# Altium schematic sheet TOP.SchDoc: TOP
size A3; CompanyName: STMicroelectronics; Organization: Microcontrollers Division; DocumentNumber: 3; SheetNumber: 2; SheetTotal: 19
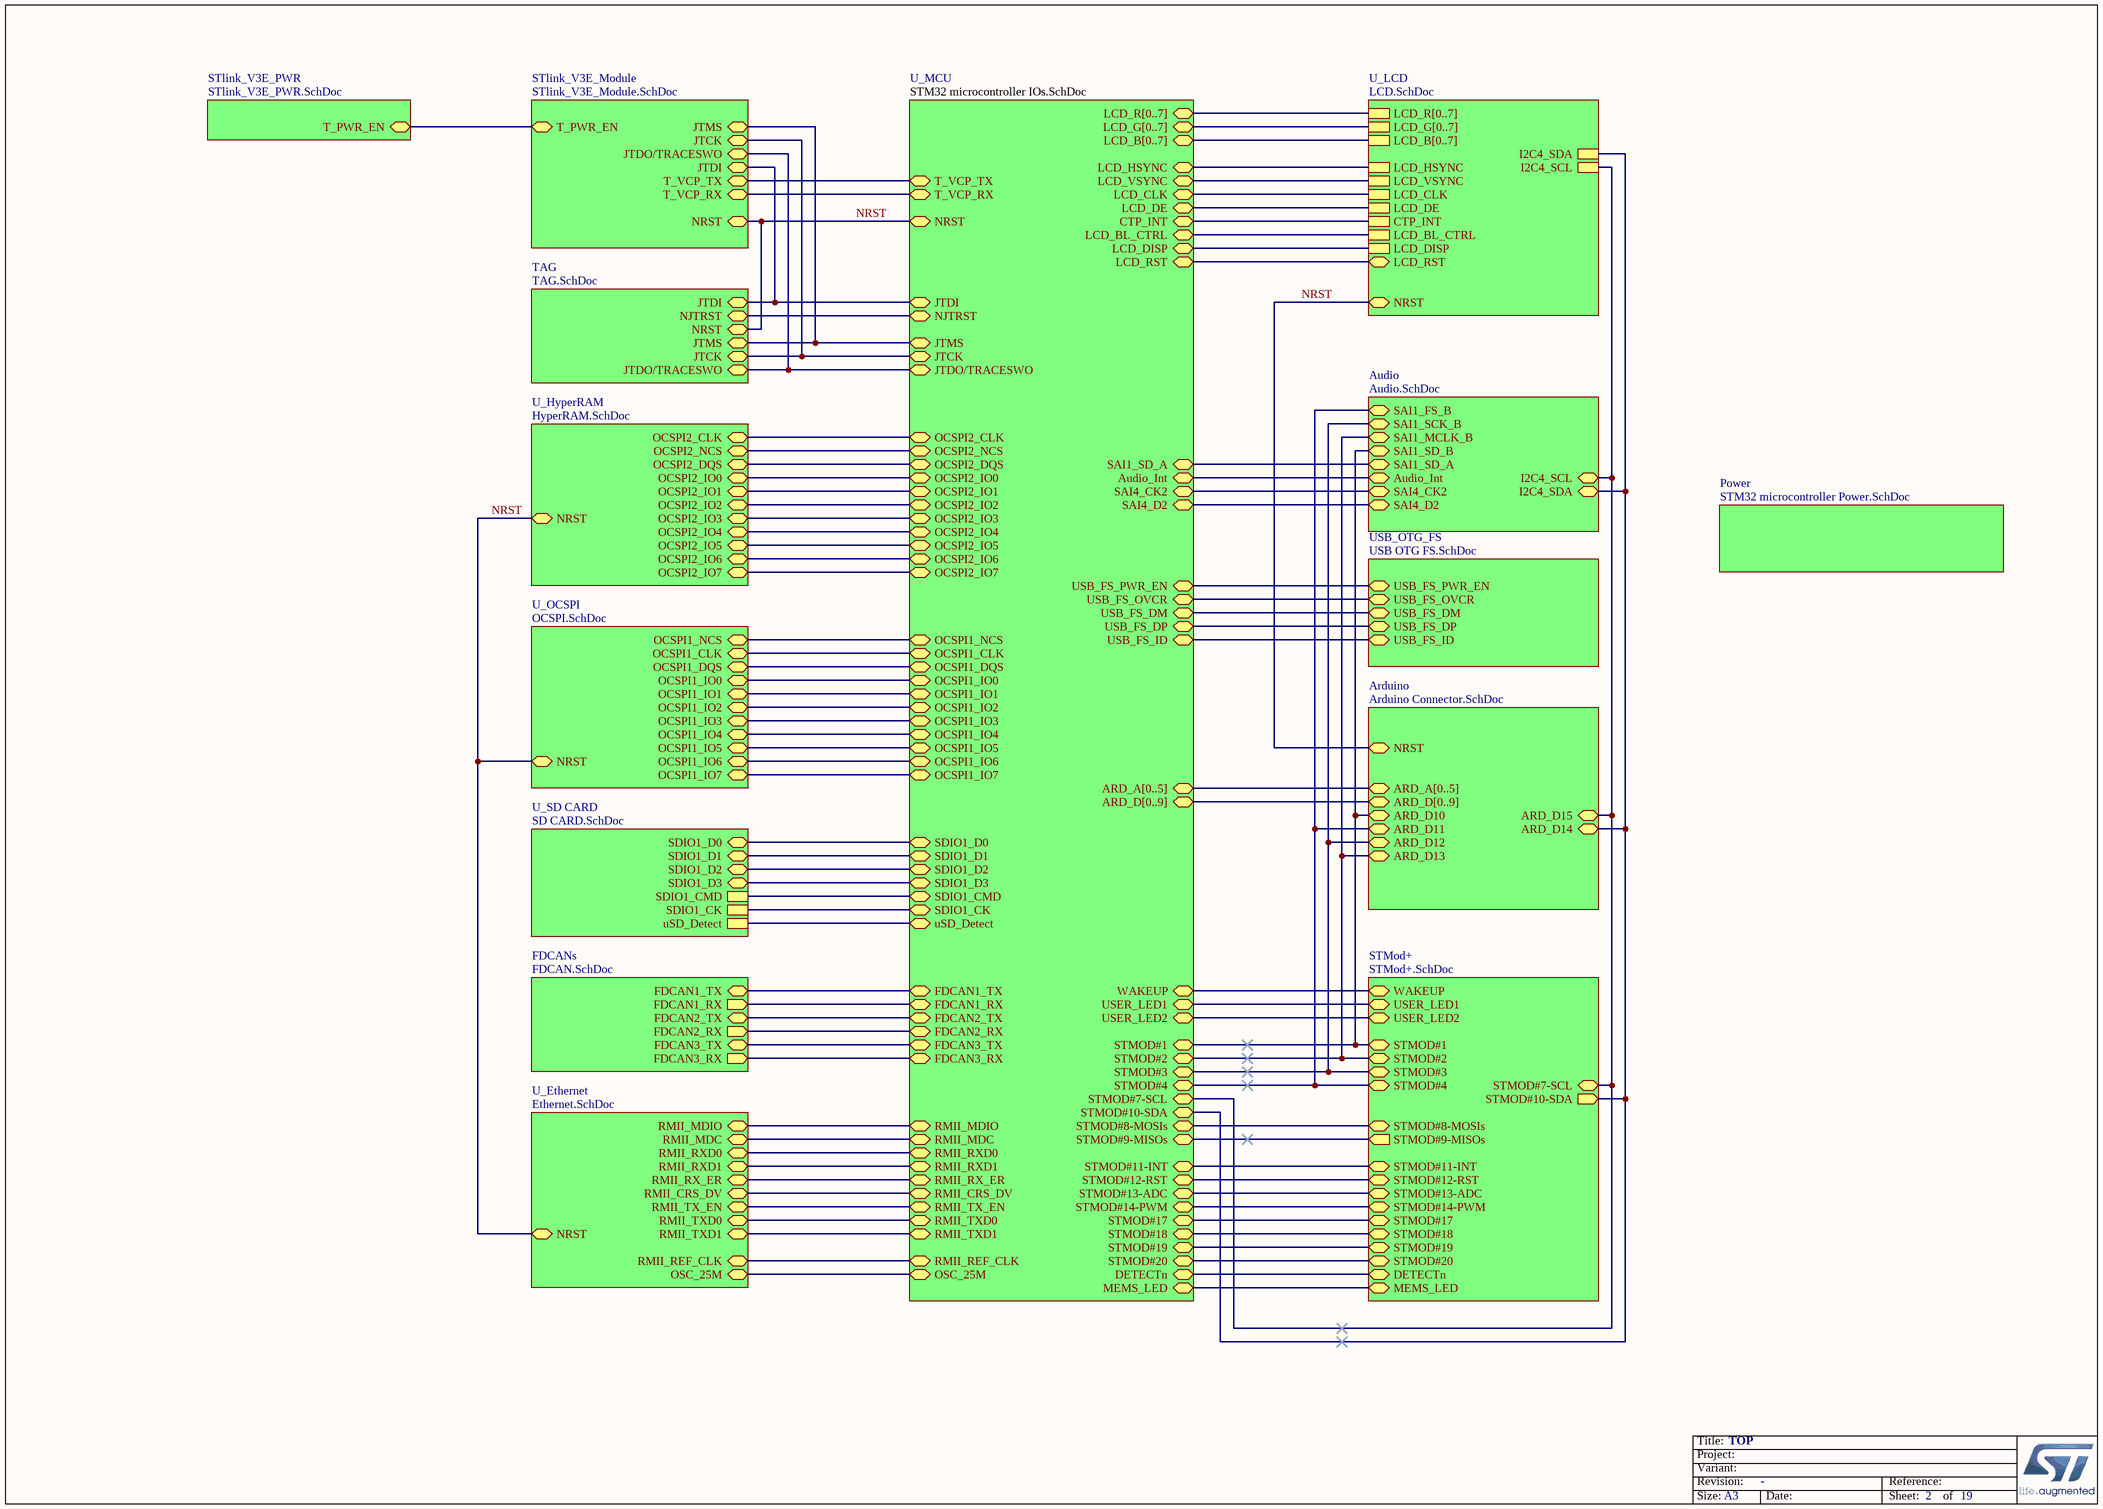
[diagram p0: TOP.SchDoc]

## Sub-sheets
Arduino = Arduino Connector.SchDoc: ARD_D13, ARD_D12, ARD_D11, ARD_D10, ARD_D15, ARD_D14, ARD_A[0..5], ARD_D[0..9], NRST
Audio = Audio.SchDoc: I2C4_SCL, I2C4_SDA, SAI1_SCK_B, SAI1_FS_B, SAI1_SD_B, SAI1_SD_A, Audio_Int, SAI1_MCLK_B, SAI4_D2, SAI4_CK2
FDCANs = FDCAN.SchDoc: FDCAN1_TX, FDCAN2_TX, FDCAN3_TX, FDCAN1_RX (out), FDCAN3_RX (out), FDCAN2_RX (out)
Power = STM32 microcontroller Power.SchDoc: no entries
STlink_V3E_Module = STlink_V3E_Module.SchDoc: T_PWR_EN, T_VCP_TX, T_VCP_RX, JTDO/TRACESWO, JTMS, JTCK, NRST, JTDI
STlink_V3E_PWR = STlink_V3E_PWR.SchDoc: T_PWR_EN
STMod+ = STMod+.SchDoc: STMOD#8-MOSIs, STMOD#14-PWM, STMOD#19, STMOD#20, STMOD#17, STMOD#18, STMOD#1, STMOD#3, STMOD#2, STMOD#4, WAKEUP, USER_LED1, USER_LED2, STMOD#7-SCL, STMOD#10-SDA (out), STMOD#9-MISOs (out), STMOD#12-RST, STMOD#13-ADC, STMOD#11-INT, DETECTn, MEMS_LED
TAG = TAG.SchDoc: JTDO/TRACESWO, JTDI, NJTRST, JTMS, JTCK, NRST
U_Ethernet = Ethernet.SchDoc: OSC_25M, RMII_MDIO, RMII_MDC, RMII_RXD1, RMII_TXD1, RMII_CRS_DV, RMII_RX_ER, RMII_RXD0, RMII_REF_CLK, RMII_TX_EN, RMII_TXD0, NRST
U_HyperRAM = HyperRAM.SchDoc: OCSPI2_NCS (bidir), NRST (bidir), OCSPI2_CLK (bidir), OCSPI2_DQS (bidir), OCSPI2_IO0 (bidir), OCSPI2_IO3 (bidir), OCSPI2_IO1 (bidir), OCSPI2_IO2 (bidir), OCSPI2_IO5 (bidir), OCSPI2_IO4 (bidir), OCSPI2_IO7 (bidir), OCSPI2_IO6 (bidir)
U_LCD = LCD.SchDoc: LCD_R[0..7], I2C4_SDA, I2C4_SCL, LCD_B[0..7], LCD_G[0..7], LCD_HSYNC, LCD_VSYNC, LCD_CLK, LCD_DE, CTP_INT, LCD_BL_CTRL, LCD_DISP, NRST, LCD_RST
U_MCU = STM32 microcontroller IOs.SchDoc: STMOD#14-PWM, STMOD#20, USB_FS_ID, SDIO1_CK, SDIO1_CMD, LCD_DE, LCD_CLK, CTP_INT, USER_LED1, USER_LED2, ARD_A[0..5], ARD_D[0..9], LCD_R[0..7], LCD_G[0..7], LCD_B[0..7], FDCAN3_RX, FDCAN3_TX, T_VCP_TX, T_VCP_RX, FDCAN2_RX, FDCAN2_TX, FDCAN1_TX, FDCAN1_RX, LCD_DISP, LCD_VSYNC, LCD_BL_CTRL, LCD_HSYNC, JTDI, JTDO/TRACESWO, NJTRST, JTCK, JTMS, OCSPI2_NCS, OCSPI1_DQS, OCSPI1_NCS, OCSPI1_CLK, OCSPI2_DQS, OSC_25M, USB_FS_DP, USB_FS_DM, USB_FS_OVCR, USB_FS_PWR_EN, WAKEUP, SAI1_SD_A, SAI4_D2, SAI4_CK2, Audio_Int, STMOD#1, STMOD#2, STMOD#3, STMOD#4, STMOD#19, STMOD#17, STMOD#18, STMOD#10-SDA, STMOD#7-SCL, STMOD#8-MOSIs, STMOD#9-MISOs, STMOD#11-INT, STMOD#13-ADC, STMOD#12-RST, MEMS_LED, DETECTn, uSD_Detect, RMII_RXD1, RMII_RXD0, RMII_CRS_DV, RMII_RX_ER, RMII_TX_EN, RMII_TXD0, RMII_TXD1, RMII_MDIO, RMII_MDC, RMII_REF_CLK, SDIO1_D1, SDIO1_D0, SDIO1_D2, SDIO1_D3, OCSPI2_CLK, NRST, OCSPI1_IO7, OCSPI1_IO4, OCSPI1_IO5, OCSPI1_IO0, OCSPI1_IO1, OCSPI1_IO3, OCSPI1_IO2, OCSPI1_IO6, OCSPI2_IO7, OCSPI2_IO6, OCSPI2_IO5, OCSPI2_IO0, OCSPI2_IO2, OCSPI2_IO1, OCSPI2_IO4, OCSPI2_IO3, LCD_RST
U_OCSPI = OCSPI.SchDoc: OCSPI1_NCS (bidir), OCSPI1_CLK (bidir), NRST, OCSPI1_DQS (bidir), OCSPI1_IO0 (bidir), OCSPI1_IO1 (bidir), OCSPI1_IO2 (bidir), OCSPI1_IO3 (bidir), OCSPI1_IO4 (bidir), OCSPI1_IO5 (bidir), OCSPI1_IO6 (bidir), OCSPI1_IO7 (bidir)
U_SD CARD = SD CARD.SchDoc: SDIO1_CK, SDIO1_CMD, uSD_Detect, SDIO1_D1, SDIO1_D0, SDIO1_D2, SDIO1_D3
USB_OTG_FS = USB OTG FS.SchDoc: USB_FS_ID, USB_FS_PWR_EN, USB_FS_OVCR, USB_FS_DM, USB_FS_DP

## Nets
NRST: sheet TAG/NRST, sheet Arduino/NRST, sheet U_MCU/NRST, sheet U_Ethernet/NRST, sheet STlink_V3E_Module/NRST, sheet U_OCSPI/NRST, sheet U_LCD/NRST, sheet U_HyperRAM/NRST
(unnamed): sheet TAG/JTDO/TRACESWO, sheet U_MCU/JTDO/TRACESWO, sheet STlink_V3E_Module/JTDO/TRACESWO
(unnamed): sheet TAG/JTDI, sheet U_MCU/JTDI, sheet STlink_V3E_Module/JTDI
(unnamed): sheet TAG/NJTRST, sheet U_MCU/NJTRST
(unnamed): sheet TAG/JTMS, sheet U_MCU/JTMS, sheet STlink_V3E_Module/JTMS
(unnamed): sheet TAG/JTCK, sheet U_MCU/JTCK, sheet STlink_V3E_Module/JTCK
(unnamed): sheet Audio/I2C4_SCL, sheet Arduino/ARD_D15, sheet STMod+/STMOD#7-SCL, sheet U_MCU/STMOD#7-SCL, sheet U_LCD/I2C4_SCL
(unnamed): sheet Audio/I2C4_SDA, sheet Arduino/ARD_D14, sheet STMod+/STMOD#10-SDA, sheet U_MCU/STMOD#10-SDA, sheet U_LCD/I2C4_SDA
(unnamed): sheet Audio/SAI1_SCK_B, sheet Arduino/ARD_D12, sheet STMod+/STMOD#3, sheet U_MCU/STMOD#3
(unnamed): sheet Audio/SAI1_FS_B, sheet Arduino/ARD_D11, sheet STMod+/STMOD#4, sheet U_MCU/STMOD#4
(unnamed): sheet Audio/SAI1_SD_B, sheet Arduino/ARD_D10, sheet STMod+/STMOD#1, sheet U_MCU/STMOD#1
(unnamed): sheet Audio/SAI1_SD_A, sheet U_MCU/SAI1_SD_A
(unnamed): sheet Audio/Audio_Int, sheet U_MCU/Audio_Int
(unnamed): sheet Audio/SAI1_MCLK_B, sheet Arduino/ARD_D13, sheet STMod+/STMOD#2, sheet U_MCU/STMOD#2
(unnamed): sheet Audio/SAI4_D2, sheet U_MCU/SAI4_D2
(unnamed): sheet Audio/SAI4_CK2, sheet U_MCU/SAI4_CK2
(unnamed): sheet USB_OTG_FS/USB_FS_ID, sheet U_MCU/USB_FS_ID
(unnamed): sheet USB_OTG_FS/USB_FS_PWR_EN, sheet U_MCU/USB_FS_PWR_EN
(unnamed): sheet USB_OTG_FS/USB_FS_OVCR, sheet U_MCU/USB_FS_OVCR
(unnamed): sheet USB_OTG_FS/USB_FS_DM, sheet U_MCU/USB_FS_DM
(unnamed): sheet USB_OTG_FS/USB_FS_DP, sheet U_MCU/USB_FS_DP
(unnamed): sheet STMod+/STMOD#8-MOSIs, sheet U_MCU/STMOD#8-MOSIs
(unnamed): sheet STMod+/STMOD#14-PWM, sheet U_MCU/STMOD#14-PWM
(unnamed): sheet STMod+/STMOD#19, sheet U_MCU/STMOD#19
(unnamed): sheet STMod+/STMOD#20, sheet U_MCU/STMOD#20
(unnamed): sheet STMod+/STMOD#17, sheet U_MCU/STMOD#17
(unnamed): sheet STMod+/STMOD#18, sheet U_MCU/STMOD#18
(unnamed): sheet STMod+/WAKEUP, sheet U_MCU/WAKEUP
(unnamed): sheet STMod+/USER_LED1, sheet U_MCU/USER_LED1
(unnamed): sheet STMod+/USER_LED2, sheet U_MCU/USER_LED2
(unnamed): sheet STMod+/STMOD#9-MISOs, sheet U_MCU/STMOD#9-MISOs
(unnamed): sheet STMod+/STMOD#12-RST, sheet U_MCU/STMOD#12-RST
(unnamed): sheet STMod+/STMOD#13-ADC, sheet U_MCU/STMOD#13-ADC
(unnamed): sheet STMod+/STMOD#11-INT, sheet U_MCU/STMOD#11-INT
(unnamed): sheet STMod+/DETECTn, sheet U_MCU/DETECTn
(unnamed): sheet STMod+/MEMS_LED, sheet U_MCU/MEMS_LED
(unnamed): sheet U_MCU/SDIO1_CK, sheet U_SD CARD/SDIO1_CK
(unnamed): sheet U_MCU/SDIO1_CMD, sheet U_SD CARD/SDIO1_CMD
(unnamed): sheet U_MCU/LCD_DE, sheet U_LCD/LCD_DE
(unnamed): sheet U_MCU/LCD_CLK, sheet U_LCD/LCD_CLK
(unnamed): sheet U_MCU/CTP_INT, sheet U_LCD/CTP_INT
(unnamed): sheet U_MCU/FDCAN3_RX, sheet FDCANs/FDCAN3_RX
(unnamed): sheet U_MCU/FDCAN3_TX, sheet FDCANs/FDCAN3_TX
(unnamed): sheet U_MCU/T_VCP_TX, sheet STlink_V3E_Module/T_VCP_TX
(unnamed): sheet U_MCU/T_VCP_RX, sheet STlink_V3E_Module/T_VCP_RX
(unnamed): sheet U_MCU/FDCAN2_RX, sheet FDCANs/FDCAN2_RX
(unnamed): sheet U_MCU/FDCAN2_TX, sheet FDCANs/FDCAN2_TX
(unnamed): sheet U_MCU/FDCAN1_TX, sheet FDCANs/FDCAN1_TX
(unnamed): sheet U_MCU/FDCAN1_RX, sheet FDCANs/FDCAN1_RX
(unnamed): sheet U_MCU/LCD_DISP, sheet U_LCD/LCD_DISP
(unnamed): sheet U_MCU/LCD_VSYNC, sheet U_LCD/LCD_VSYNC
(unnamed): sheet U_MCU/LCD_BL_CTRL, sheet U_LCD/LCD_BL_CTRL
(unnamed): sheet U_MCU/LCD_HSYNC, sheet U_LCD/LCD_HSYNC
(unnamed): sheet U_MCU/OCSPI2_NCS, sheet U_HyperRAM/OCSPI2_NCS
(unnamed): sheet U_MCU/OCSPI1_DQS, sheet U_OCSPI/OCSPI1_DQS
(unnamed): sheet U_MCU/OCSPI1_NCS, sheet U_OCSPI/OCSPI1_NCS
(unnamed): sheet U_MCU/OCSPI1_CLK, sheet U_OCSPI/OCSPI1_CLK
(unnamed): sheet U_MCU/OCSPI2_DQS, sheet U_HyperRAM/OCSPI2_DQS
(unnamed): sheet U_MCU/OSC_25M, sheet U_Ethernet/OSC_25M
(unnamed): sheet U_MCU/uSD_Detect, sheet U_SD CARD/uSD_Detect
(unnamed): sheet U_MCU/RMII_RXD1, sheet U_Ethernet/RMII_RXD1
(unnamed): sheet U_MCU/RMII_RXD0, sheet U_Ethernet/RMII_RXD0
(unnamed): sheet U_MCU/RMII_CRS_DV, sheet U_Ethernet/RMII_CRS_DV
(unnamed): sheet U_MCU/RMII_RX_ER, sheet U_Ethernet/RMII_RX_ER
(unnamed): sheet U_MCU/RMII_TX_EN, sheet U_Ethernet/RMII_TX_EN
(unnamed): sheet U_MCU/RMII_TXD0, sheet U_Ethernet/RMII_TXD0
(unnamed): sheet U_MCU/RMII_TXD1, sheet U_Ethernet/RMII_TXD1
(unnamed): sheet U_MCU/RMII_MDIO, sheet U_Ethernet/RMII_MDIO
(unnamed): sheet U_MCU/RMII_MDC, sheet U_Ethernet/RMII_MDC
(unnamed): sheet U_MCU/RMII_REF_CLK, sheet U_Ethernet/RMII_REF_CLK
(unnamed): sheet U_MCU/SDIO1_D1, sheet U_SD CARD/SDIO1_D1
(unnamed): sheet U_MCU/SDIO1_D0, sheet U_SD CARD/SDIO1_D0
(unnamed): sheet U_MCU/SDIO1_D2, sheet U_SD CARD/SDIO1_D2
(unnamed): sheet U_MCU/SDIO1_D3, sheet U_SD CARD/SDIO1_D3
(unnamed): sheet U_MCU/OCSPI2_CLK, sheet U_HyperRAM/OCSPI2_CLK
(unnamed): sheet U_MCU/OCSPI1_IO7, sheet U_OCSPI/OCSPI1_IO7
(unnamed): sheet U_MCU/OCSPI1_IO4, sheet U_OCSPI/OCSPI1_IO4
(unnamed): sheet U_MCU/OCSPI1_IO5, sheet U_OCSPI/OCSPI1_IO5
(unnamed): sheet U_MCU/OCSPI1_IO0, sheet U_OCSPI/OCSPI1_IO0
(unnamed): sheet U_MCU/OCSPI1_IO1, sheet U_OCSPI/OCSPI1_IO1
(unnamed): sheet U_MCU/OCSPI1_IO3, sheet U_OCSPI/OCSPI1_IO3
(unnamed): sheet U_MCU/OCSPI1_IO2, sheet U_OCSPI/OCSPI1_IO2
(unnamed): sheet U_MCU/OCSPI1_IO6, sheet U_OCSPI/OCSPI1_IO6
(unnamed): sheet U_MCU/OCSPI2_IO7, sheet U_HyperRAM/OCSPI2_IO7
(unnamed): sheet U_MCU/OCSPI2_IO6, sheet U_HyperRAM/OCSPI2_IO6
(unnamed): sheet U_MCU/OCSPI2_IO5, sheet U_HyperRAM/OCSPI2_IO5
(unnamed): sheet U_MCU/OCSPI2_IO0, sheet U_HyperRAM/OCSPI2_IO0
(unnamed): sheet U_MCU/OCSPI2_IO2, sheet U_HyperRAM/OCSPI2_IO2
(unnamed): sheet U_MCU/OCSPI2_IO1, sheet U_HyperRAM/OCSPI2_IO1
(unnamed): sheet U_MCU/OCSPI2_IO4, sheet U_HyperRAM/OCSPI2_IO4
(unnamed): sheet U_MCU/OCSPI2_IO3, sheet U_HyperRAM/OCSPI2_IO3
(unnamed): sheet U_MCU/LCD_RST, sheet U_LCD/LCD_RST
(unnamed): sheet STlink_V3E_Module/T_PWR_EN, sheet STlink_V3E_PWR/T_PWR_EN

## Buses and harness runs
bus sheet Arduino/ARD_A[0..5] = sheet U_MCU/ARD_A[0..5]
bus sheet Arduino/ARD_D[0..9] = sheet U_MCU/ARD_D[0..9]
bus sheet U_LCD/LCD_B[0..7] = sheet U_MCU/LCD_B[0..7]
bus sheet U_LCD/LCD_G[0..7] = sheet U_MCU/LCD_G[0..7]
bus sheet U_LCD/LCD_R[0..7] = sheet U_MCU/LCD_R[0..7]

## Notes on the sheet
- Title:
- Project:
- Size:
- Revision:
- Variant:
- A3
- -
- Date:
- Reference:
- Sheet:
- of